# Altium schematic sheet Zynq-Power.SchDoc: Zynq-Power
size A4; DrawnBy: Omar Moussa; Engineer: Omar Moussa; DocumentNumber: 2; Revision: A; SheetNumber: 2; SheetTotal: 10
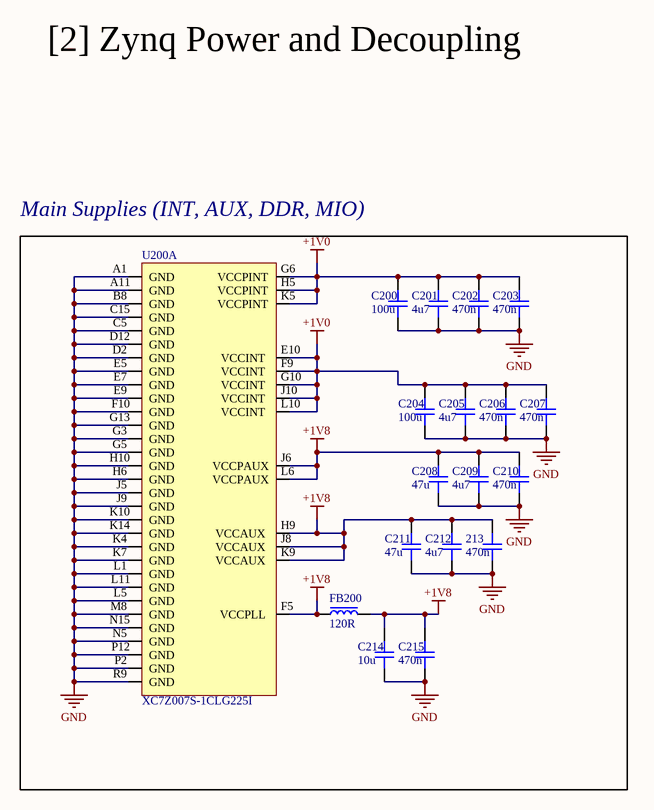
[diagram p0: Zynq-Power.SchDoc]

## Parts
213  470n  [CAP_1210]
C200  100u  [CAP_1210]
C201  4u7  [CAP_1210]
C202  470n  [CAP_1210]
C203  470n  [CAP_1210]
C204  100u  [CAP_1210]
C205  4u7  [CAP_1210]
C206  470n  [CAP_1210]
C207  470n  [CAP_1210]
C208  47u  [CAP_1210]
C209  4u7  [CAP_1210]
C210  470n  [CAP_1210]
C211  47u  [CAP_1210]
C212  4u7  [CAP_1210]
C214  10u  [CAP_1210]
C215  470n  [CAP_1210]
FB200  120R  [FB_0402]
U200  XC7Z007S-1CLG225I  [CLG225]  (part A of 7)

## Blocks framed on the sheet
Main Supplies (INT, AUX, DDR, MIO): 213 C200-C212 C214 C215 FB200 U200

## Nets
+1V0: C200.2 C201.2 C202.2 C203.2 C204.2 C205.2 C206.2 C207.2 U200.E10(VCCINT) U200.F9(VCCINT) U200.G6(VCCPINT) U200.G10(VCCINT) U200.H5(VCCPINT) U200.J10(VCCINT) U200.K5(VCCPINT) U200.L10(VCCINT)
+1V8: 213.2 C208.2 C209.2 C210.2 C211.2 C212.2 C214.2 C215.2 FB200.1 FB200.2 U200.F5(VCCPLL) U200.H9(VCCAUX) U200.J6(VCCPAUX) U200.J8(VCCAUX) U200.K9(VCCAUX) U200.L6(VCCPAUX)
GND: 213.1 C200.1 C201.1 C202.1 C203.1 C204.1 C205.1 C206.1 C207.1 C208.1 C209.1 C210.1 C211.1 C212.1 C214.1 C215.1 U200.A1(GND) U200.A11(GND) U200.B8(GND) U200.C5(GND) U200.C15(GND) U200.D2(GND) U200.D12(GND) U200.E5(GND) U200.E7(GND) U200.E9(GND) U200.F10(GND) U200.G3(GND) U200.G5(GND) U200.G13(GND) U200.H6(GND) U200.H10(GND) U200.J5(GND) U200.J9(GND) U200.K4(GND) U200.K7(GND) U200.K10(GND) U200.K14(GND) U200.L1(GND) U200.L5(GND) U200.L11(GND) U200.M8(GND) U200.N5(GND) U200.N15(GND) U200.P2(GND) U200.P12(GND) U200.R9(GND)

## Notes on the sheet
- [2] Zynq Power and Decoupling
- Title
- Size:
- Date:
- A4
- Number:
- Time:
- Revision:
- Sheet
- of
- File:

## Library data of the parts
213 C200-C212 C214 C215 = CAP_1210: Capacitor SMD 1210; Manufacturer: *; Manufacturer Part Number: *; Distributor Link: *; LCSC: *; Rating: *; Dielectric: *
FB200 = FB_0402: Ferrite Bead SMD 0402; Manufacturer: *; Manufacturer Part Number: *; Distributor Link: *; LCSC: *
U200 = XC7Z007S-1CLG225I: Xilinx FPGA SoC Zynq 7-Series XC7Z007S CLG255 Package Industrial Temperature Grade; Manufacturer: Xilinx; Manufacturer Part Number: XC7Z007S-1CLG225I